# EAGLE design M901X (EAGLE 6.6.0)
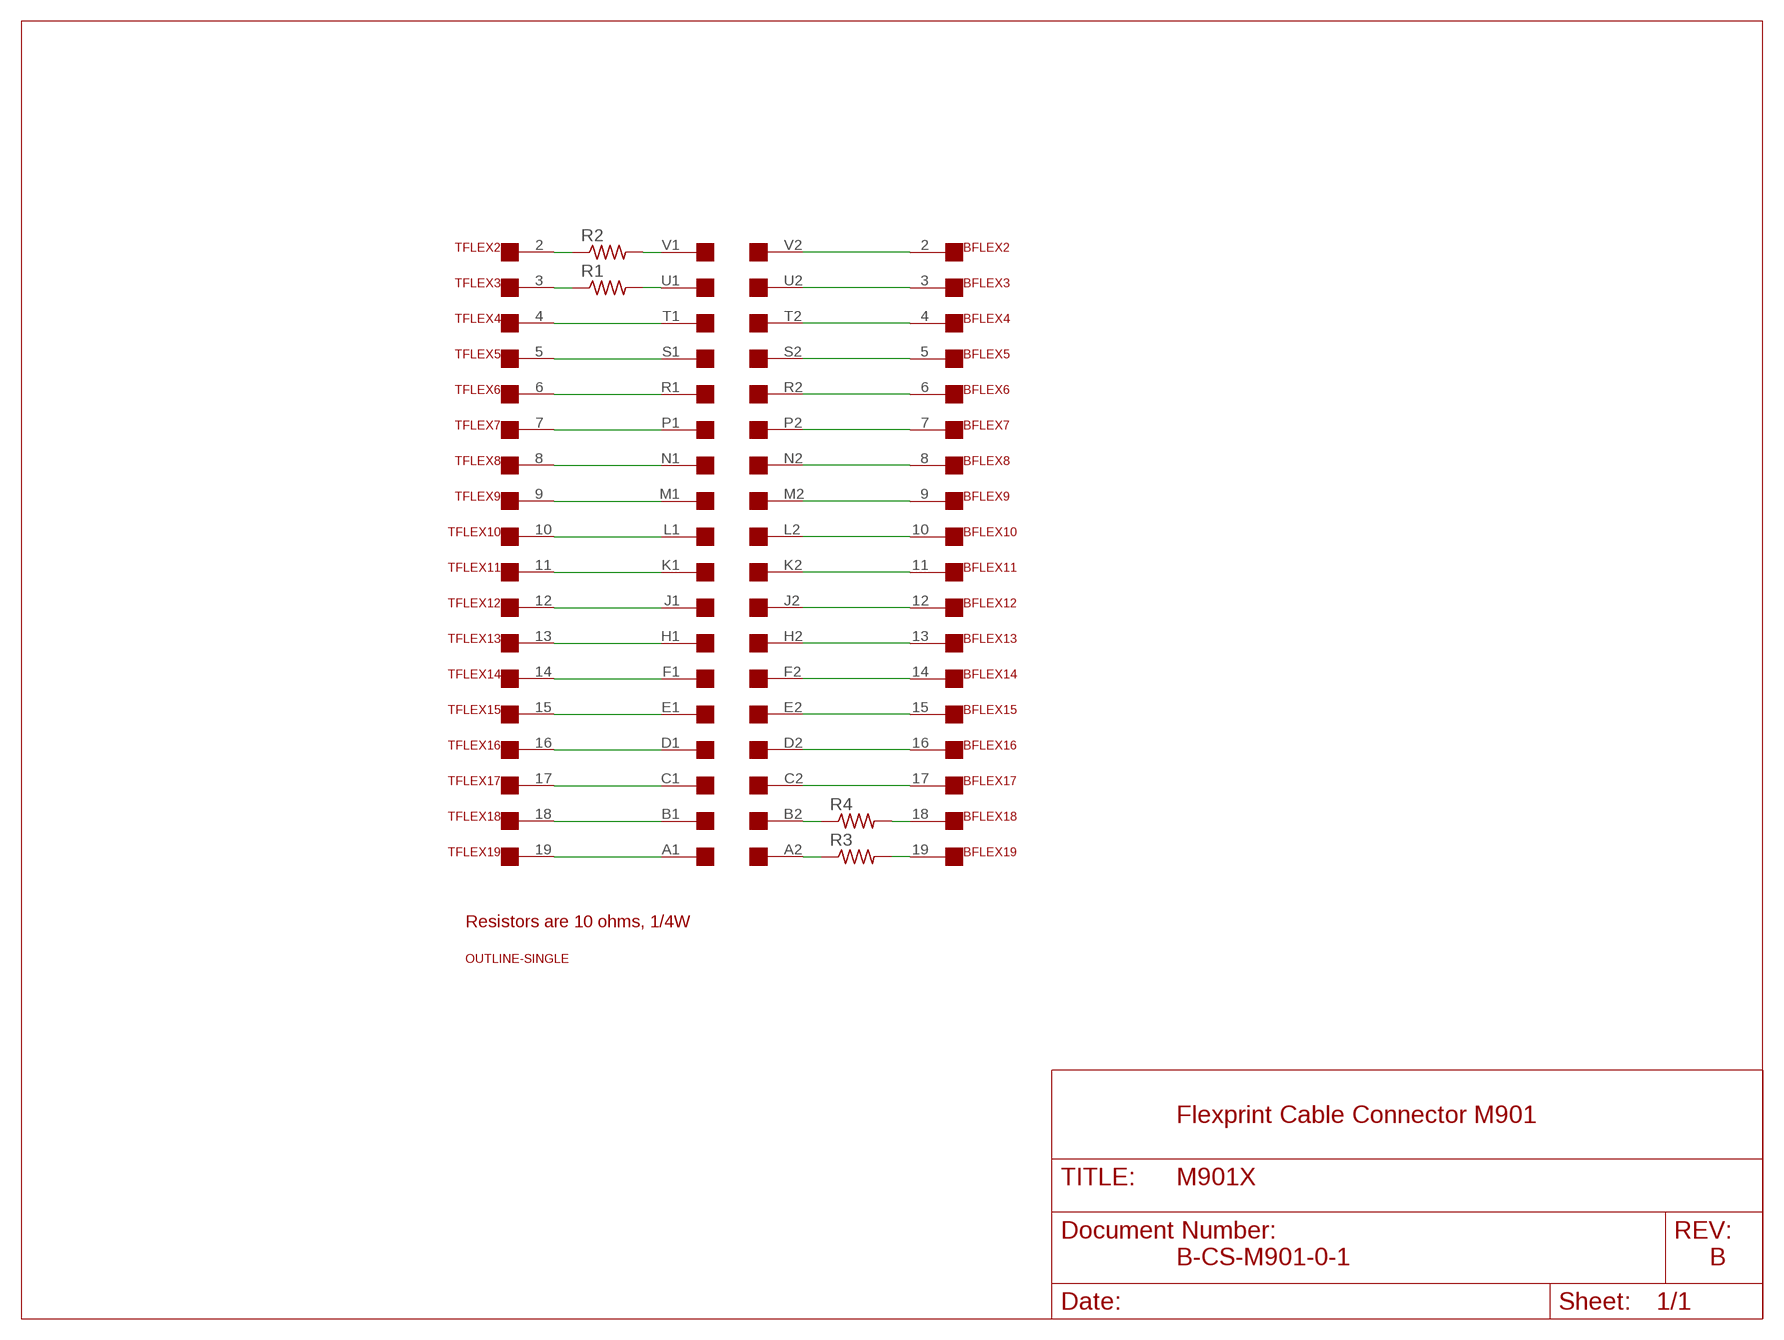
[diagram p0: schematic, sheet 1]

## Parts
BFLEX  FLEX19  [FLEX19]
R1  R-US_0207/10  [0207/10]
R2  R-US_0207/10  [0207/10]
R3  R-US_0207/10  [0207/10]
R4  R-US_0207/10  [0207/10]
TFLEX  FLEX19  [FLEX19]
U$1  SINGLE  [EDGE-CON2]
U$2  OUTLINE-SINGLE  [SINGLE]

## Nets
N$1: TFLEX.4 U$1.T1
N$2: TFLEX.19 U$1.A1
N$3: TFLEX.17 U$1.C1
N$4: TFLEX.16 U$1.D1
N$5: TFLEX.15 U$1.E1
N$6: TFLEX.14 U$1.F1
N$7: TFLEX.13 U$1.H1
N$8: TFLEX.12 U$1.J1
N$9: TFLEX.11 U$1.K1
N$10: TFLEX.10 U$1.L1
N$11: TFLEX.9 U$1.M1
N$12: TFLEX.8 U$1.N1
N$13: TFLEX.7 U$1.P1
N$14: TFLEX.6 U$1.R1
N$15: TFLEX.5 U$1.S1
N$16: BFLEX.3 U$1.U2
N$17: BFLEX.6 U$1.R2
N$18: BFLEX.8 U$1.N2
N$19: BFLEX.10 U$1.L2
N$20: BFLEX.12 U$1.J2
N$21: BFLEX.14 U$1.F2
N$22: BFLEX.16 U$1.D2
N$23: BFLEX.15 U$1.E2
N$24: BFLEX.17 U$1.C2
N$25: BFLEX.13 U$1.H2
N$26: R3.1 U$1.A2
N$27: BFLEX.11 U$1.K2
N$28: BFLEX.19 R3.2
N$29: BFLEX.9 U$1.M2
N$30: BFLEX.18 R4.2
N$31: BFLEX.7 U$1.P2
N$32: R4.1 U$1.B2
N$33: BFLEX.5 U$1.S2
N$34: BFLEX.4 U$1.T2
N$35: R2.1 TFLEX.2
N$36: BFLEX.2 U$1.V2
N$37: R1.1 TFLEX.3
N$38: R1.2 U$1.U1
N$39: R2.2 U$1.V1
N$42: TFLEX.18 U$1.B1
Unconnected: BFLEX.1 TFLEX.1

## Notes on the sheet
- Resistors are 10 ohms, 1/4W
- Flexprint Cable Connector M901
- B-CS-M901-0-1 | B

## Library data of the parts
BFLEX TFLEX = dec-con:FLEX19: 19 pin Flexprint Connection
R1-R4 = rcl:R-US_: RESISTOR, American symbol
U$1 = dec-con:SINGLE: Single-Height DEC board
U$2 = dec-con:OUTLINE-*: Board outlines for DEC boards.

## Board
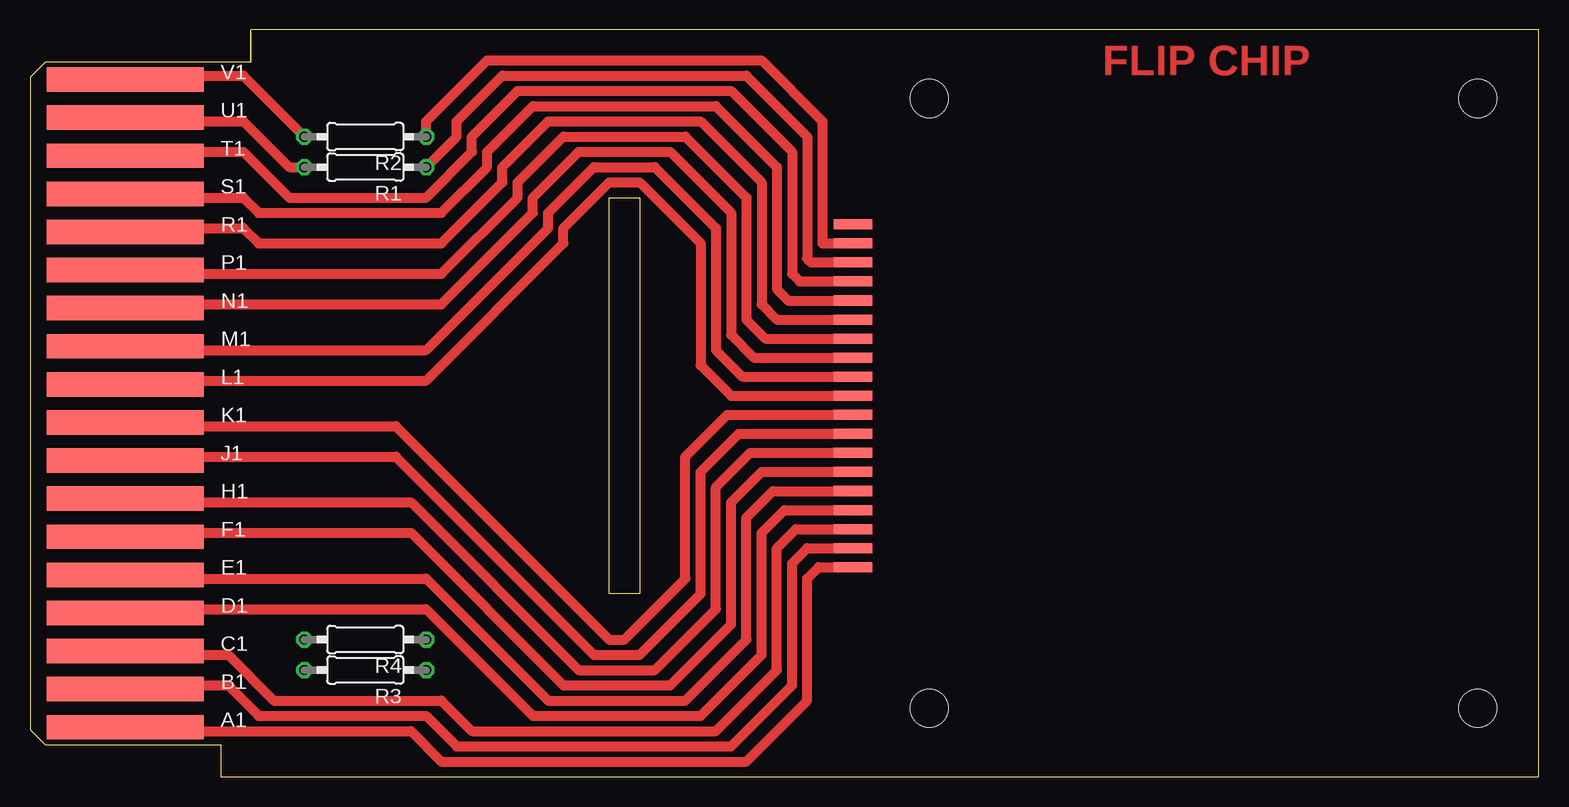
[diagram p1: board, top side]
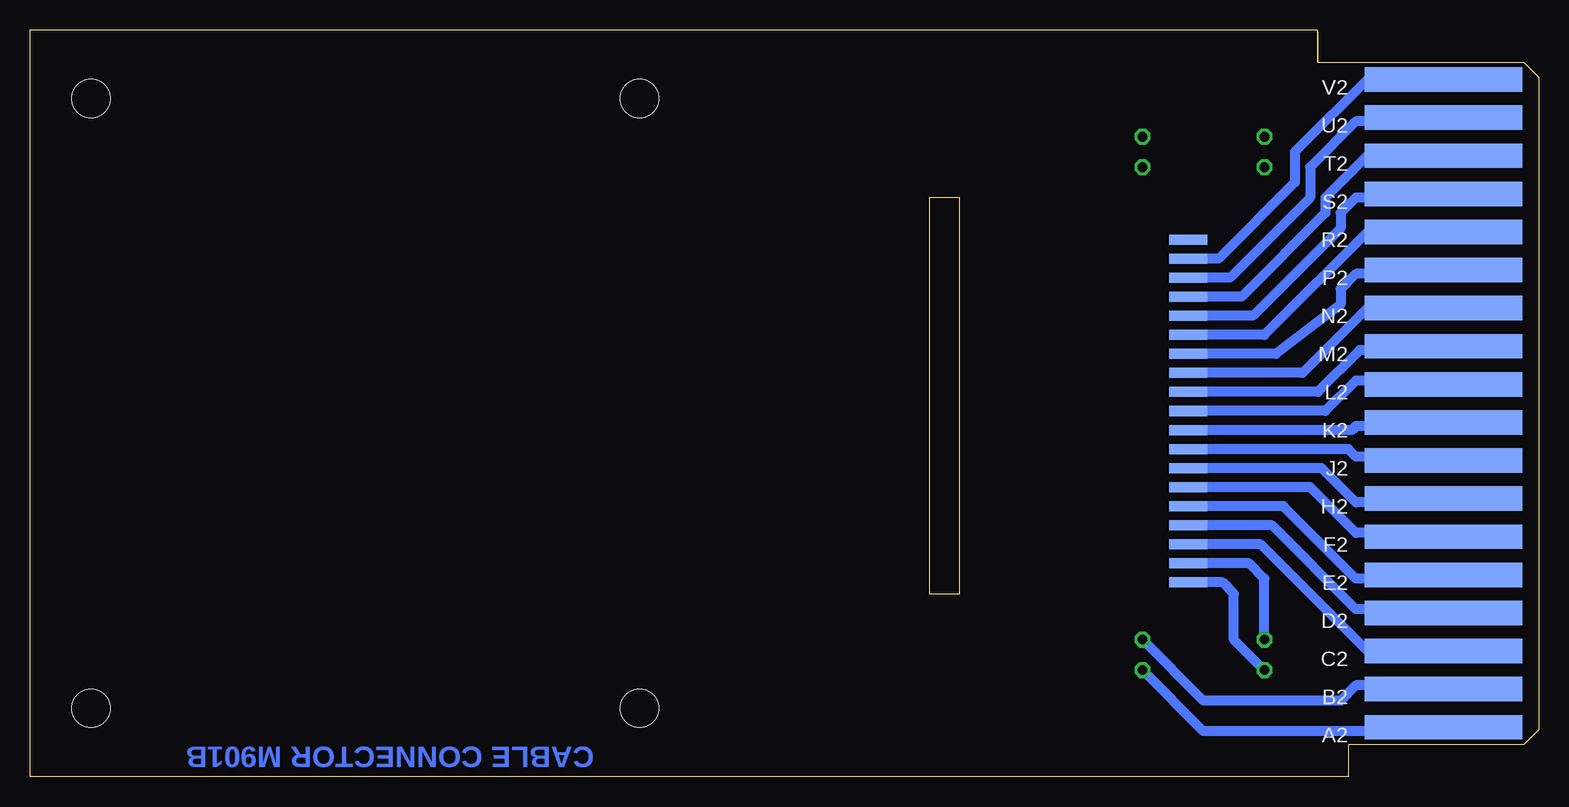
[diagram p2: board, bottom side, seen from below]

Size 125.73 x 62.23 mm. Coordinates in mm from the lower left corner, seen from the top.
Outline: 48.26,48.26 50.8,48.26 50.8,15.24 48.26,15.24 48.26,48.26
Copper layers (1+16): Top 0.035mm / dielectric 1.5mm / Bottom 0.035mm
Design rules "16mils": minimum track width 16mil, minimum drill 32mil, track to track 15mil, track to pad 10mil, pad to pad 10mil, via to via 10mil, smd to smd 10mil, copper to edge 13mil, drill to drill 10mil, minimum pad ring 10mil, minimum via ring 8mil, stop-mask expansion 0mil, vias tented up to drill 0mil, thermal gap 10mil
Holes 3.17 mm at 74.93,5.71 74.93,56.52

### Footprints (pad centres in the part's own frame; a part is rotated, then mirrored left to right if it is on the bottom)
FLEX19 = smd 3.175 x 0.838: 1 0,14.287; 2 0,12.7; 3 0,11.113; 4 0,9.525; 5 0,7.938; 6 0,6.35; 7 0,4.763; 8 0,3.175; 9 0,1.587; 10 0,0; 11 0,-1.587; 12 0,-3.175; 13 0,-4.763; 14 0,-6.35; 15 0,-7.938; 16 0,-9.525; 17 0,-11.113; 18 0,-12.7; 19 0,-14.287
0207/10 = drill 0.813 octagon: 1 -5.08,0; 2 5.08,0
EDGE-CON2 = smd 13.106 x 2.032: A1 7.938,4.128; B1 7.938,7.303; C1 7.938,10.477; D1 7.938,13.652; E1 7.938,16.828; F1 7.938,20.003; H1 7.938,23.177; J1 7.938,26.352; K1 7.938,29.527; L1 7.938,32.703; M1 7.938,35.877; N1 7.938,39.053; P1 7.938,42.227; R1 7.938,45.403; S1 7.938,48.578; T1 7.938,51.752; U1 7.938,54.928; V1 7.938,58.102 | smd 13.106 x 2.032 bottom: A2 7.938,4.128; B2 7.938,7.303; C2 7.938,10.477; D2 7.938,13.652; E2 7.938,16.828; F2 7.938,20.003; H2 7.938,23.177; J2 7.938,26.352; K2 7.938,29.527; L2 7.938,32.703; M2 7.938,35.877; N2 7.938,39.053; P2 7.938,42.227; R2 7.938,45.403; S2 7.938,48.578; T2 7.938,51.752; U2 7.938,54.928; V2 7.938,58.102
SINGLE = hole 3.175: 120.65,56.515; 120.65,5.715

### Placement (x,y rotation side)
BFLEX  29.21,30.48 0 bottom
R1  27.94,50.8 180 top
R2  27.94,53.34 180 top
R3  27.94,8.89 180 top
R4  27.94,11.43 180 top
TFLEX  68.58,31.75 0 top
U$1  0,0 0 top
U$2  0,0 0 top
U$3  [FLIPCHIP]  125.73,55.88 90 top

### Tracks (layer width: path | path; a pad name or v marks a point on that pad's centre or on a via)
N$1
  Top 0.813: U$1.T1 8.26,52.07 17.78,52.07 21.59,48.26 33.02,48.26 36.83,52.07 36.83,53.34 40.64,57.15 58.42,57.15 63.5,52.07 63.5,41.91 64.14,41.27 TFLEX.4
N$2
  Top 0.813: U$1.A1 8.26,3.81 31.75,3.81 34.29,1.27 59.69,1.27 64.77,6.35 64.77,16.51 65.72,17.46 TFLEX.19
N$3
  Top 0.813: U$1.C1 8.26,10.16 16.51,10.16 20.32,6.35 34.29,6.35 36.83,3.81 57.15,3.81 62.23,8.89 62.23,19.05 63.82,20.64 TFLEX.17
N$4
  Top 0.813: U$1.D1 8.26,13.97 33.02,13.97 41.91,5.08 55.88,5.08 60.96,10.16 60.96,20.32 62.87,22.23 TFLEX.16
N$5
  Top 0.813: U$1.E1 8.26,16.51 33.02,16.51 43.18,6.35 54.61,6.35 59.69,11.43 59.69,21.59 61.91,23.81 TFLEX.15
N$6
  Top 0.813: U$1.F1 8.26,20.32 31.75,20.32 44.45,7.62 53.34,7.62 58.42,12.7 58.42,22.86 60.96,25.4 TFLEX.14
N$7
  Top 0.813: U$1.H1 8.26,22.86 31.75,22.86 45.72,8.89 52.07,8.89 57.15,13.97 57.15,24.13 60.01,26.99 TFLEX.13
N$8
  Top 0.813: U$1.J1 8.26,26.67 30.48,26.67 46.99,10.16 50.8,10.16 55.88,15.24 55.88,25.4 59.06,28.57 TFLEX.12
N$9
  Top 0.813: U$1.K1 8.26,29.21 30.48,29.21 48.26,11.43 49.53,11.43 54.61,16.51 54.61,26.67 58.1,30.16 TFLEX.11
N$10
  Top 0.813: U$1.L1 8.26,33.02 33.02,33.02 44.45,44.45 44.45,45.72 48.26,49.53 50.8,49.53 55.88,44.45 55.88,34.29 58.42,31.75 TFLEX.10
N$11
  Top 0.813: U$1.M1 8.26,35.56 33.02,35.56 43.18,45.72 43.18,46.99 46.99,50.8 52.07,50.8 57.15,45.72 57.15,35.56 59.37,33.34 TFLEX.9
N$12
  Top 0.813: U$1.N1 8.26,39.37 34.29,39.37 41.91,46.99 41.91,48.26 45.72,52.07 53.34,52.07 58.42,46.99 58.42,36.83 60.33,34.92 TFLEX.8
N$13
  Top 0.813: U$1.P1 8.26,41.91 34.29,41.91 40.64,48.26 40.64,49.53 44.45,53.34 54.61,53.34 59.69,48.26 59.69,38.1 61.28,36.51 TFLEX.7
N$14
  Top 0.813: U$1.R1 8.26,45.72 17.78,45.72 19.05,44.45 34.29,44.45 39.37,49.53 39.37,50.8 43.18,54.61 55.88,54.61 60.96,49.53 60.96,39.37 62.23,38.1 TFLEX.6
N$15
  Top 0.813: U$1.S1 8.26,48.26 17.78,48.26 19.05,46.99 34.29,46.99 38.1,50.8 38.1,52.07 41.91,55.88 57.15,55.88 62.23,50.8 62.23,40.64 63.18,39.69 TFLEX.5
N$16
  Bottom 0.813: U$1.U2 8.26,54.61 15.24,54.61 19.05,50.8 19.05,48.26 25.72,41.59 BFLEX.3
N$17
  Bottom 0.813: U$1.R2 8.26,45.72 13.97,45.72 22.86,36.83 BFLEX.6
N$18
  Bottom 0.813: U$1.N2 8.26,39.37 13.97,39.37 19.69,33.66 BFLEX.8
N$19
  Bottom 0.813: U$1.L2 8.26,33.02 15.24,33.02 17.78,30.48 BFLEX.10
N$20
  Bottom 0.813: U$1.J2 8.26,26.67 15.24,26.67 15.88,27.3 BFLEX.12
N$21
  Bottom 0.813: U$1.F2 8.26,20.32 15.24,20.32 19.05,24.13 BFLEX.14
N$22
  Bottom 0.813: U$1.D2 8.26,13.97 15.24,13.97 22.23,20.95 BFLEX.16
N$23
  Bottom 0.813: U$1.E2 8.26,16.51 15.24,16.51 21.27,22.54 BFLEX.15
N$24
  Bottom 0.813: U$1.C2 8.26,10.16 13.97,10.16 23.18,19.37 BFLEX.17
N$25
  Bottom 0.813: U$1.H2 8.26,22.86 15.24,22.86 18.1,25.72 BFLEX.13
N$26
  Bottom 0.813: U$1.A2 8.26,3.81 27.94,3.81 R3.1
N$27
  Bottom 0.813: U$1.K2 8.26,29.21 15.24,29.21 15.56,28.89 BFLEX.11
N$28
  Bottom 0.813: R3.2 25.4,11.43 25.4,15.24 26.35,16.19 BFLEX.19
N$29
  Bottom 0.813: U$1.M2 8.26,35.56 14.92,35.56 18.42,32.07 BFLEX.9
N$30
  Bottom 0.813: R4.2 22.86,16.51 24.13,17.78 BFLEX.18
N$31
  Bottom 0.813: U$1.P2 8.26,41.91 15.24,41.91 16.51,40.64 16.51,39.37 21.91,35.24 BFLEX.7
N$32
  Bottom 0.813: U$1.B2 8.26,7.62 15.24,7.62 16.51,6.35 27.94,6.35 R4.1
N$33
  Bottom 0.813: U$1.S2 8.26,48.26 15.24,48.26 16.51,46.99 16.51,45.72 23.81,38.42 BFLEX.5
N$34
  Bottom 0.813: U$1.T2 8.26,52.07 13.97,52.07 17.78,48.26 17.78,46.99 24.77,40.01 BFLEX.4
N$35
  Top 0.813: R2.1 33.02,54.61 38.1,59.69 60.96,59.69 66.04,54.61 66.04,44.45 TFLEX.2
N$36
  Bottom 0.813: U$1.V2 8.26,58.42 13.97,58.42 20.32,52.07 20.32,49.53 26.67,43.18 BFLEX.2
N$37
  Top 0.813: R1.1 35.56,53.34 35.56,54.61 39.37,58.42 59.69,58.42 64.77,53.34 64.77,43.18 65.09,42.86 TFLEX.3
N$38
  Top 0.813: U$1.U1 8.26,54.61 17.78,54.61 21.59,50.8 R1.2
N$39
  Top 0.813: U$1.V1 8.26,58.42 17.78,58.42 R2.2
N$42
  Top 0.813: U$1.B1 8.26,7.62 16.51,7.62 19.05,5.08 33.02,5.08 35.56,2.54 58.42,2.54 63.5,7.62 63.5,17.78 64.77,19.05 TFLEX.18

### Text on the board
Bottom: CABLE CONNECTOR M901B
200bmp: C:/Users/Vince/Documents/websvn/trunk/Eagle/projects/DEC/Mxxx/M901/M901Bfrontb.bmp
201bmp: C:/Users/Vince/Documents/websvn/trunk/Eagle/projects/DEC/Mxxx/M901/M901Bbackfb.bmp